# Altium schematic sheet MCU_Board_fNIRS.SchDoc
size A; SheetNumber: 1; SheetTotal: 2
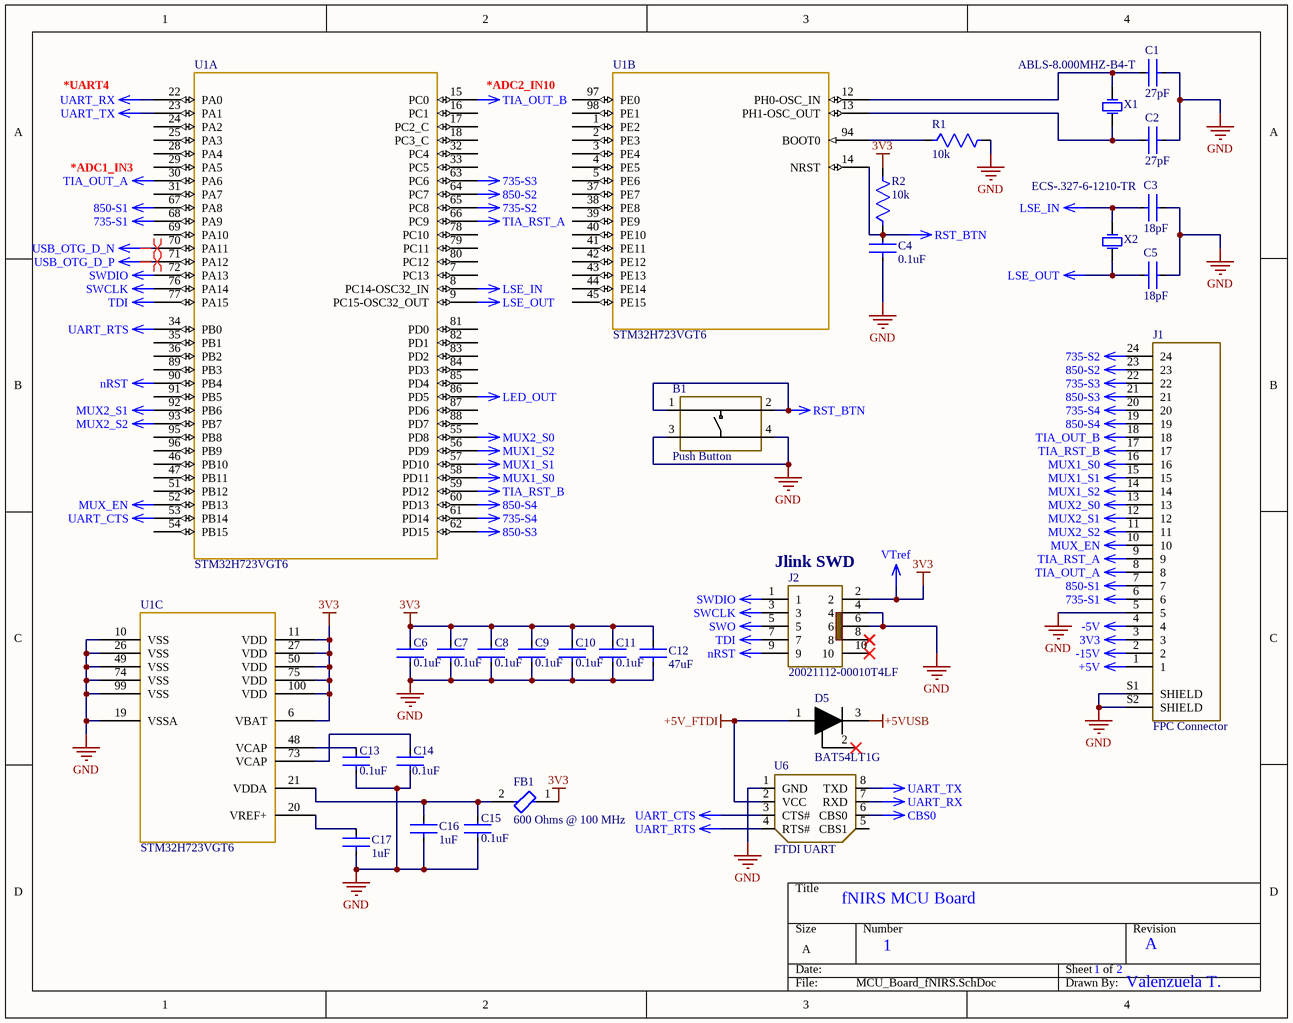
[diagram p0: MCU_Board_fNIRS.SchDoc]

## Parts
B1  Push Button  [PTS810]
C1  27pF  [CAPC3216X180N]
C2  27pF  [CAPC3216X180N]
C3  18pF  [CAPC3216X180N]
C4  0.1uF  [CAPC3216X180N]
C5  18pF  [CAPC3216X180N]
C6  0.1uF  [CAPC3216X180N]
C7  0.1uF  [CAPC3216X180N]
C8  0.1uF  [CAPC3216X180N]
C9  0.1uF  [CAPC3216X180N]
C10  0.1uF  [CAPC3216X180N]
C11  0.1uF  [CAPC3216X180N]
C12  47uF  [CAPC3216X180N]
C13  0.1uF  [CAPC3216X180N]
C14  0.1uF  [CAPC3216X180N]
C15  0.1uF  [CAPC3216X180N]
C16  1uF  [CAPC1206(3216)130_M]
C17  1uF  [CAPC1206(3216)130_M]
D5  BAT54LT1G  [BAT54LT1]
FB1  600 Ohms @ 100 MHz  [BEADC1608X95N]
J1  FPC Connector  [TE_FPC]
J2  20021112-00010T4LF  [AMPHENOL_20021112-00010T4LF]
R1  10k  [R1206]
R2  10k  [R1206]
U1  STM32H723VGT6  [LQFP100_STM]  (parts A,B,C of 3)
U6  FTDI UART  [UB232R]
X1  ABLS-8.000MHZ-B4-T  [ABRA-ABLS-14.7456MHZ-B2-T_V]
X2  ECS-.327-6-1210-TR  [ECS-.327-6-1210-TR]

## Nets
3V3: C6.2 C7.2 C8.2 C9.2 C10.2 C11.2 C12.2 FB1.1 J1.3 J2.2 R2.2 U1.6(VBAT) U1.11(VDD) U1.27(VDD) U1.50(VDD) U1.75(VDD) U1.100(VDD)  [also labelled VTref]
735-S1: J1.6 U1.68(PA9)
735-S2: J1.24 U1.65(PC8)
735-S3: J1.22 U1.63(PC6)
735-S4: J1.20 U1.61(PD14)
850-S1: J1.7 U1.67(PA8)
850-S2: J1.23 U1.64(PC7)
850-S3: J1.21 U1.62(PD15)
850-S4: J1.19 U1.60(PD13)
+5V: J1.1
+5V_FTDI: D5.1(A) U6.2(VCC)
+5VUSB: D5.3(K)
-5V: J1.4
-15V: J1.2
CBS0: U6.6(CBS0)
GND: B1.3 B1.4 C1.1 C2.1 C3.2 C4.1 C5.2 C6.1 C7.1 C8.1 C9.1 C10.1 C11.1 C12.1 C13.1 C14.1 C15.1 C16.1 C17.1 J1.5 J1.S1(SHIELD) J1.S2(SHIELD) J2.4 J2.6 R1.2 U1.10(VSS) U1.19(VSSA) U1.26(VSS) U1.49(VSS) U1.74(VSS) U1.99(VSS) U6.1(GND)
LED_OUT: U1.86(PD5)
LSE_IN: C3.1 U1.8(PC14-OSC32_IN) X2.2(X2)
LSE_OUT: C5.1 U1.9(PC15-OSC32_OUT) X2.1(X1)
MUX1_S0: J1.16 U1.58(PD11)
MUX1_S1: J1.15 U1.57(PD10)
MUX1_S2: J1.14 U1.56(PD9)
MUX2_S0: J1.13 U1.55(PD8)
MUX2_S1: J1.12 U1.92(PB6)
MUX2_S2: J1.11 U1.93(PB7)
MUX_EN: J1.10 U1.52(PB13)
nRST: J2.9 U1.90(PB4)
RST_BTN: B1.1 B1.2 C4.2 R2.1 U1.14(NRST)
SWCLK: J2.3 U1.76(PA14)
SWDIO: J2.1 U1.72(PA13)
SWO: J2.5
TDI: J2.7 U1.77(PA15)
TIA_OUT_A: J1.8 U1.30(PA6)
TIA_OUT_B: J1.18 U1.15(PC0)
TIA_RST_A: J1.9 U1.66(PC9)
TIA_RST_B: J1.17 U1.59(PD12)
UART_CTS: U1.53(PB14) U6.3(CTS#)
UART_RTS: U1.34(PB0) U6.4(RTS#)
UART_RX: U1.22(PA0) U6.7(RXD)
UART_TX: U1.23(PA1) U6.8(TXD)
USB_OTG_D_N: U1.70(PA11)
USB_OTG_D_P: U1.71(PA12)
NetC1_2: C1.2 U1.12(PH0-OSC_IN) X1.1(X1)
NetC2_2: C2.2 U1.13(PH1-OSC_OUT) X1.2(X2)
NetC13_2: C13.2 U1.48(VCAP)
NetC14_2: C14.2 U1.73(VCAP)
NetC15_2: C15.2 C16.2 FB1.2 U1.21(VDDA)
NetC17_2: C17.2 U1.20(VREF+)
NetR1_1: R1.1 U1.94(BOOT0)

Not connected (* = marked no-connect by the designer): D5 2(NC)*; J2 8* 10*; U1 1(PE2) 2(PE3) 3(PE4) 4(PE5) 5(PE6) 7(PC13) 16(PC1) 17(PC2_C) 18(PC3_C) 24(PA2) 25(PA3) 28(PA4) 29(PA5) 31(PA7) 32(PC4) 33(PC5) 35(PB1) 36(PB2) 37(PE7) 38(PE8) 39(PE9) 40(PE10) 41(PE11) 42(PE12) 43(PE13) 44(PE14) 45(PE15) 46(PB10) 47(PB11) 51(PB12) 54(PB15) 69(PA10) 78(PC10) 79(PC11) 80(PC12) 81(PD0) 82(PD1) 83(PD2) 84(PD3) 85(PD4) 87(PD6) 88(PD7) 89(PB3) 91(PB5) 95(PB8) 96(PB9) 97(PE0) 98(PE1); U6 5(CBS1)

## Layout directives
differential pair: USB_OTG_D_N, USB_OTG_D_P

## Notes on the sheet
- *UART4
- (near U1) *ADC2_IN10
- *ADC1_IN3
- (near J2) Jlink SWD
- fNIRS MCU Board
- 1
- 2
- A
- Valenzuela T.

## Library data of the parts
B1 = PTS810 SJG 250 SMTR LFS: Tactile Switch SPST-NO Top Actuated Surface Mount
C1 C2 = C1206C270K5GAC7800: CAP CER 27PF 50V C0G/NP0 1206; Tolerance: -20% to +80%; Value: 1uF; Case-Metric: 3216; Rated Voltage: 25 V; Case-EIA: 1206; Max Thickness: 1.3 mm; Technology: SMT
C3 C5 = C1206C180J5GAC7800: 18 pF ±5% 50V Ceramic Capacitor C0G, NP0 1206 (3216 Metric); Tolerance: -20% to +80%; Value: 1uF; Case-Metric: 3216; Rated Voltage: 25 V; Case-EIA: 1206; Max Thickness: 1.3 mm; Technology: SMT
C4 C6-C11 C13-C15 = C1206C104K5RAC7210: 1206; Manufacturer: KEMET; Tolerance: 0.1; Material: Ceramic; Voltage Rating: 50 V; Temperature Characteristic: X7R; Automotive Grade: Grade 0; Capacitance: 0.10 μF; Value: 0.10 μF; Temperature Coefficient: 15%; Device Class L3: Ceramic Capacitors; ComponentLink2URL: https://content.kemet.com/datasheets/KEM_C1007_X8R_ULTRA_150C_SMD.pdf; Temperature Range Low: -55°C; RoHS: TRUE; Temperature Range High: +150°C; Automotive: Yes; Height: 0.88mm; Manufacturer Part Number: C1206C104K5RAC7210; Temperature: -55°C to +150°C; Octopart: https://octopart.com/c1206c104k5rac7210-kemet-3919856; Package: C1206C-EB; Mouser Description: Multilayer Ceramic Capacitors MLCC - SMD/SMT 50volts 0.1uF X7R 10%; Ipc Land Pattern Name: CAPC320160X78; Device Class L2: Capacitors; Category: Cap; Lead Free: Yes; ComponentLink2Description: Datasheet; Digikey Description: CAP CER 0.1UF 50V X7R 1206; Device Class L1: Passive Components
C12 = CL31A476MQHNNWE: 47 µF ±20% 6.3V Ceramic Capacitor X5R 1206 (3216 Metric); Tolerance: -20% to +80%; Value: 1uF; Case-Metric: 3216; Rated Voltage: 25 V; Case-EIA: 1206; Max Thickness: 1.3 mm; Technology: SMT
C16 = 12063G105ZAT4A_1: CAP 1uF 25V -20% to +80% 1206 (3216 Metric) Thickness 1.3mm SMD / C1206C105Z3VAC7800; Case-Metric: 3216; Case-EIA: 1206; Tolerance: -20% to +80%; Value: 1uF; Max Thickness: 1.3 mm; Technology: SMT; Rated Voltage: 25 V
C17 = 12063G105ZAT4A_1: CAP 1uF 25V -20% to +80% 1206 (3216 Metric) Thickness 1.3mm SMD; Case-Metric: 3216; Case-EIA: 1206; Tolerance: -20% to +80%; Value: 1uF; Max Thickness: 1.3 mm; Technology: SMT; Rated Voltage: 25 V
D5 = BAT54L: Schottky Barrier Diode, 3-Pin SOT-23, Pb-Free, Tape and Reel; Manufacturer: On Semiconductor; IFSM Max (A): 0.6; Configuration: Single; trr Max (ns): 5; PackageVersion: Rev. AP, 11/2009; ComponentLink3Description: Package Specification; RoHS: TRUE; ComponentLink3URL: http://www.onsemi.cn/pub_link/Collateral/318-08.PDF; PackageDescription: 3-Pin Small Outline Transistor, Body 2.92 x 1.3 mm, Pitch 0.95 mm; DatasheetVersion: Rev. 12; ComponentLink1Description: Manufacturer URL; PartNumber: BAT54LT1G; ComponentLink2Description: Datasheet; Mounting Technology: Surface Mount; PackageReference: SOT-23-3-318-08; ComponentLink2URL: http://www.onsemi.cn/pub_link/Collateral/BAT54LT1-D.PDF; ComponentLink1URL: http://www.onsemi.com/; Packing: Tape and Reel
FB1 = FCM 1608KF-601T03: 600 Ohms @ 100 MHz 1 Ferrite Bead 0603 (1608 Metric) 350mA 500mOhm; Tolerance: -20% to +80%; Value: 1uF; Case-Metric: 3216; Rated Voltage: 25 V; Case-EIA: 1206; Max Thickness: 1.3 mm; Technology: SMT
J1 = 2-1734592-4: 24 Position FPC Connector Contacts, Bottom 0.020" _0.50mm_ Surface Mount, Right Angle; MF: TE Connectivity; MP: 2-1734592-4; Value: *; Package: None; Price: None; SnapEDA_Link: https://www.snapeda.com/parts/2-1734592-4/TE%20Connectivity/view-part/4788511/?ref=snap; Availability: Unavailable
J2 = 20021112-00010T4LF: Connector Header Through Hole, Right Angle 10 position 0.050" (1.27mm); MF: Amphenol; Package: None; Price: None; Check_prices: https://www.snapeda.com/parts/20021112-00010T4LF/Amphenol/view-part/?ref=eda; Value: *; SnapEDA_Link: https://www.snapeda.com/parts/20021112-00010T4LF/Amphenol/view-part/?ref=snap; MP: 20021112-00010T4LF; Availability: In Stock; Purchase-URL: https://pricing.snapeda.com/search?q=20021112-00010T4LF&ref=eda
R1 R2 = RC1206FR-0710KL: 1206 10kOhm
U1 = STM32H723VGT6: No Description Available; Mfr_Name: STMicroelectronics; RefDes: RefDes; Type: Type
U6 = UB232R: FT232R - USB 2.0 to UART (RS232) Bridge Interface Evaluation Board
X1 = ABLS-8.000MHZ-B4-T: Low Profile Crystal, 8.0 MHz, +/- 30 ppm, -20 to 70 degC, 2-Pin SMD, RoHS, Tape and Reel; Brand: ABRACON; Case Length: 11.4mm; Frequency Stability: 50PPM; ESR: 80Ohms; Case Height: 4.2mm; Tolerance: 30PPM; Frequency: 8MHz; Case Width: 4.7mm; Load Capacitance: 18pF; Datasheet Version: 04/2011; Termination Style: SMD/SMT; Dimensions: 4.7mmWx11.4mmLx4.2mmH; Packaging: Reel; Manufacturer: ABRACON; Package URL: http://www.abracon.com/Support/PackageDrawing/Resonators/ABLS-2D.pdf; Mounting Technology: SurfaceMount; Package Reference: ABLS-14.7456MHZ-B2-T; Product Category: Crystals; Package Description: 2-Pin Surface Mount Device, Body 11.4 x 4.7 mm; Package / Case: HC-49/US; Mounting Style: SMD/SMT; Operating Temperature Range: -20Cto+70C; Series: ABLS; Factory Pack Quantity: 1000; Datasheet URL: http://www.abracon.com/Resonators/abls.pdf; Manufacturer URL: http://www.abracon.com/; RoHS: Details; Type: LowProfileMicroprocessorCrystal
X2 = ECS-.327-6-1210-TR: Low Profile Crystal, 8.0 MHz, +/- 30 ppm, -20 to 70 degC, 2-Pin SMD, RoHS, Tape and Reel; Brand: ABRACON; Case Length: 11.4mm; Frequency Stability: 50PPM; ESR: 80Ohms; Case Height: 4.2mm; Tolerance: 30PPM; Frequency: 8MHz; Case Width: 4.7mm; Load Capacitance: 18pF; Datasheet Version: 04/2011; Termination Style: SMD/SMT; Dimensions: 4.7mmWx11.4mmLx4.2mmH; Packaging: Reel; Manufacturer: ABRACON; Package URL: http://www.abracon.com/Support/PackageDrawing/Resonators/ABLS-2D.pdf; Mounting Technology: SurfaceMount; Package Reference: ABLS-14.7456MHZ-B2-T; Product Category: Crystals; Package Description: 2-Pin Surface Mount Device, Body 11.4 x 4.7 mm; Package / Case: HC-49/US; Mounting Style: SMD/SMT; Operating Temperature Range: -20Cto+70C; Series: ABLS; Factory Pack Quantity: 1000; Datasheet URL: http://www.abracon.com/Resonators/abls.pdf; Manufacturer URL: http://www.abracon.com/; RoHS: Details; Type: LowProfileMicroprocessorCrystal